# Altium schematic sheet Buttons.SchDoc
size Letter; CompanyName: Ploopy Corporation; Organization: Ploopy Corporation; Address1: 137-1140 Burnhamthorpe Road W; Address2: Mississauga; Address3: Ontario; Address4: Canada L5C 0A3; DocumentNumber: 2; Revision: R2.003; SheetNumber: 2; SheetTotal: 8
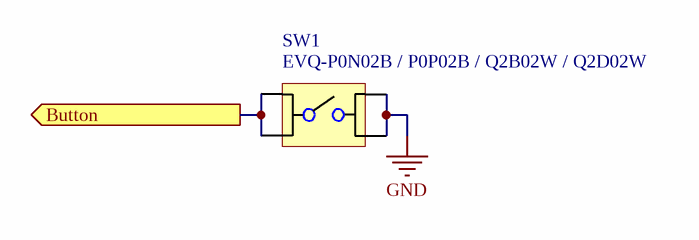
[diagram p0: Buttons.SchDoc]

## Parts
SW1  EVQ-P0N02B / P0P02B / Q2B02W / Q2D02W  [EVQ-Q2D02W Switch]

## Ports
Button (out)

## Nets
GND: SW1.B
Button: SW1.A ; port Button

## Notes on the sheet
- Copyright Ploopy Corporation 2024
- Licensed under the CERN-OHL-S v2
- http://ohwr.org/cernohl
- Title:
- PCB:
- Version:
- Ploopy Corporation
- Mississauga ON L5C 0A3
- 137-1140 Burnhamthorpe Road W
- Date:
- Time:
- Sheet
- of
- Canada

## Library data of the parts
SW1 = EVQ-Q2D02W: Tactile Switch SPST-NO Top Actuated Surface Mount